# EAGLE design BUS (EAGLE 7.6.0)
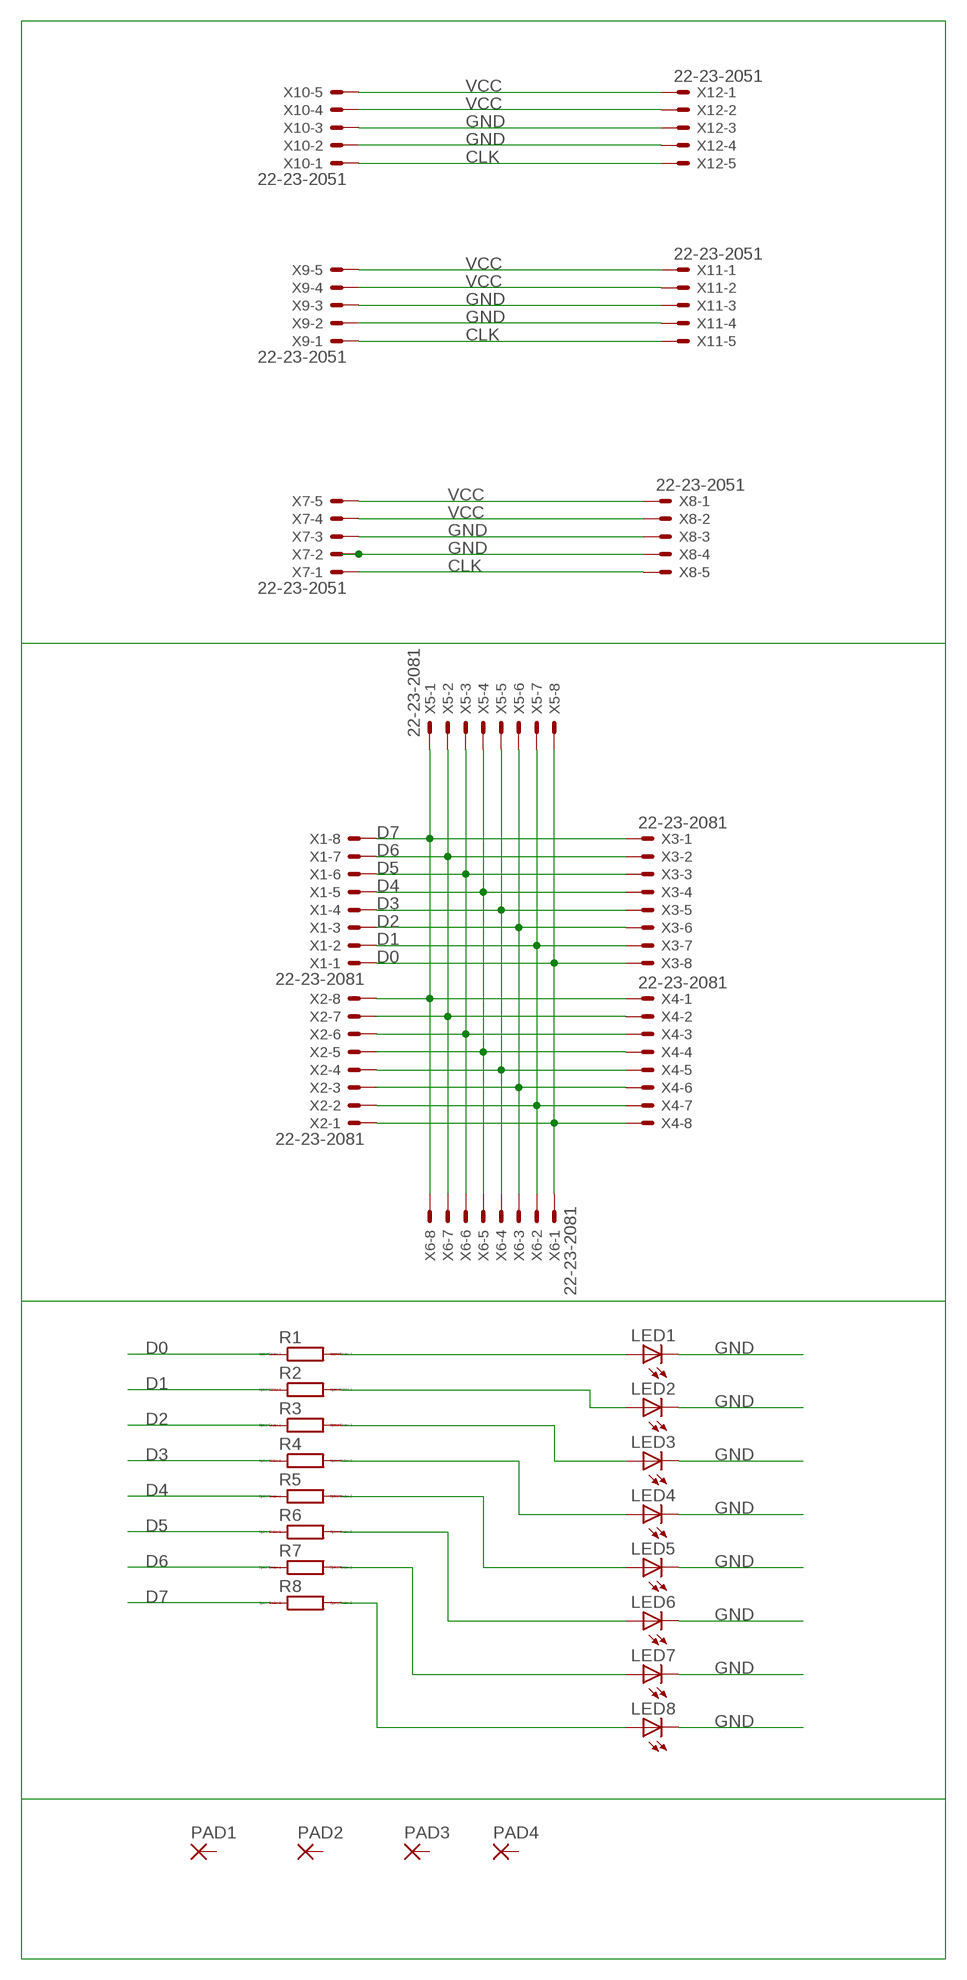
[diagram p0: schematic, sheet 1]

## Parts
LED1  LED5MM  [LED5MM]
LED2  LED5MM  [LED5MM]
LED3  LED5MM  [LED5MM]
LED4  LED5MM  [LED5MM]
LED5  LED5MM  [LED5MM]
LED6  LED5MM  [LED5MM]
LED7  LED5MM  [LED5MM]
LED8  LED5MM  [LED5MM]
PAD1  3,17/1,1  [3,17/1,1]
PAD2  3,17/1,1  [3,17/1,1]
PAD3  3,17/1,1  [3,17/1,1]
PAD4  3,17/1,1  [3,17/1,1]
R1  R0207/10  [0207/10]
R2  R0207/10  [0207/10]
R3  R0207/10  [0207/10]
R4  R0207/10  [0207/10]
R5  R0207/10  [0207/10]
R6  R0207/10  [0207/10]
R7  R0207/10  [0207/10]
R8  R0207/10  [0207/10]
X1  22-23-2081  [22-23-2081]
X2  22-23-2081  [22-23-2081]
X3  22-23-2081  [22-23-2081]
X4  22-23-2081  [22-23-2081]
X5  22-23-2081  [22-23-2081]
X6  22-23-2081  [22-23-2081]
X7  22-23-2051  [22-23-2051]
X8  22-23-2051  [22-23-2051]
X9  22-23-2051  [22-23-2051]
X10  22-23-2051  [22-23-2051]
X11  22-23-2051  [22-23-2051]
X12  22-23-2051  [22-23-2051]

## Nets
CLK [supply]: X7.1 X8.5 X9.1 X10.1 X11.5 X12.5
D0: R1.1 X1.1 X2.1 X3.8 X4.8 X5.8 X6.1
D1: R2.1 X1.2 X2.2 X3.7 X4.7 X5.7 X6.2
D2: R3.1 X1.3 X2.3 X3.6 X4.6 X5.6 X6.3
D3: R4.1 X1.4 X2.4 X3.5 X4.5 X5.5 X6.4
D4: R5.1 X1.5 X2.5 X3.4 X4.4 X5.4 X6.5
D5: R6.1 X1.6 X2.6 X3.3 X4.3 X5.3 X6.6
D6: R7.1 X1.7 X2.7 X3.2 X4.2 X5.2 X6.7
D7: R8.1 X1.8 X2.8 X3.1 X4.1 X5.1 X6.8
GND [supply]: LED1.K(C) LED2.K(C) LED3.K(C) LED4.K(C) LED5.K(C) LED6.K(C) LED7.K(C) LED8.K(C) X7.2 X7.3 X8.3 X8.4 X9.2 X9.3 X10.2 X10.3 X11.3 X11.4 X12.3 X12.4
N$9: LED1.A R1.2
N$10: LED2.A R2.2
N$11: LED3.A R3.2
N$12: LED4.A R4.2
N$13: LED5.A R5.2
N$14: LED6.A R6.2
N$15: LED7.A R7.2
N$16: LED8.A R8.2
VCC [supply]: X7.4 X7.5 X8.1 X8.2 X9.4 X9.5 X10.4 X10.5 X11.1 X11.2 X12.1 X12.2
Unconnected: PAD1.1(P) PAD2.1(P) PAD3.1(P) PAD4.1(P)

## Library data of the parts
LED1-LED8 = led:LED: LED OSRAM: - CHIPLED LG R971, LG N971, LY N971, LG Q971, LY Q971, LO R971, LY R971 LH N974, LH R974 LS Q976, LO Q976, LY Q976 LO Q996 - Hyper CHIPLED LW Q18S LB Q993, LB Q99A, LB R99A - SideLED LS A670, LO A670, LY A670, LG A670, LP A670 LB A673, LV A673, LT A673, LW A673 LH A674 LY A675 LS A676, LA A676, LO A676, LY A676, LW A676 LS A679, LY A679, LG A679 - Hyper Micro SIDELED® LS Y876, LA Y876, LO Y876, LY Y876 LT Y87S - SmartLED LW L88C, LW L88S LB L89C, LB L89S, LG L890 LS L89K, LO L89K, LY L89K LS L896, LA L896, LO L896, LY L896 - TOPLED LS T670, LO T670, LY T670, LG T670, LP T670 LSG T670, LSP T670, LSY T670, LOP T670, LYG T670 LG T671, LOG T671, LSG T671 LB T673, LV T673, LT T673, LW T673 LH T674 LS T676, LA T676, LO T676, LY T676, LB T676, LH T676, LSB T676, LW T676 LB T67C, LV T67C, LT T67C, LS T67K, LO T67K, LY T67K, LW E67C LS E67B, LA E67B, LO E67B, LY E67B, LB E67C, LV E67C, LT E67C LW T67C LS T679, LY T679, LG T679 LS T770, LO T770, LY T770, LG T770, LP T770 LB T773, LV T773, LT T773, LW T773 LH T774 LS E675, LA E675, LY E675, LS T675 LS T776, LA T776, LO T776, LY T776, LB T776 LHGB T686 LT T68C, LB T68C - Hyper Mini TOPLED® LB M676 - Mini TOPLED Santana® LG M470 LS M47K, LO M47K, LY M47K Source: http://www.osram.convergy.de LUXEON: - LUMILED® LXK2-PW12-R00, LXK2-PW12-S00, LXK2-PW14-U00, LXK2-PW14-V00 LXK2-PM12-R00, LXK2-PM12-S00, LXK2-PM14-U00 LXK2-PE12-Q00, LXK2-PE12-R00, LXK2-PE12-S00, LXK2-PE14-T00, LXK2-PE14-U00 LXK2-PB12-K00, LXK2-PB12-L00, LXK2-PB12-M00, LXK2-PB14-N00, LXK2-PB14-P00, LXK2-PB14-Q00 LXK2-PR12-L00, LXK2-PR12-M00, LXK2-PR14-Q00, LXK2-PR14-R00 LXK2-PD12-Q00, LXK2-PD12-R00, LXK2-PD12-S00 LXK2-PH12-R00, LXK2-PH12-S00 LXK2-PL12-P00, LXK2-PL12-Q00, LXK2-PL12-R00 Source: www.luxeon.com KINGBRIGHT: KA-3528ASYC Source: www.kingbright.com
PAD1-PAD4 = wirepad:3,17/1,1: THROUGH-HOLE PAD
R1-R8 = eagle-ltspice:R: RESISTOR, European symbol; SPICEMODEL: NONE; SPICEPREFIX: R
X1-X6 = con-molex:22-23-2081: .100" (2.54mm) Center Header - 8 Pin; MF: MOLEX; MPN: 22-23-2081; OC_FARNELL: 1756826; OC_NEWARK: 01C7592
X7-X12 = con-molex:22-23-2051: .100" (2.54mm) Center Header - 5 Pin; MF: MOLEX; MPN: 22-23-2051; OC_FARNELL: 1462952; OC_NEWARK: 38C9178

## Net classes
1 supply: width 2.032 mm

## Board
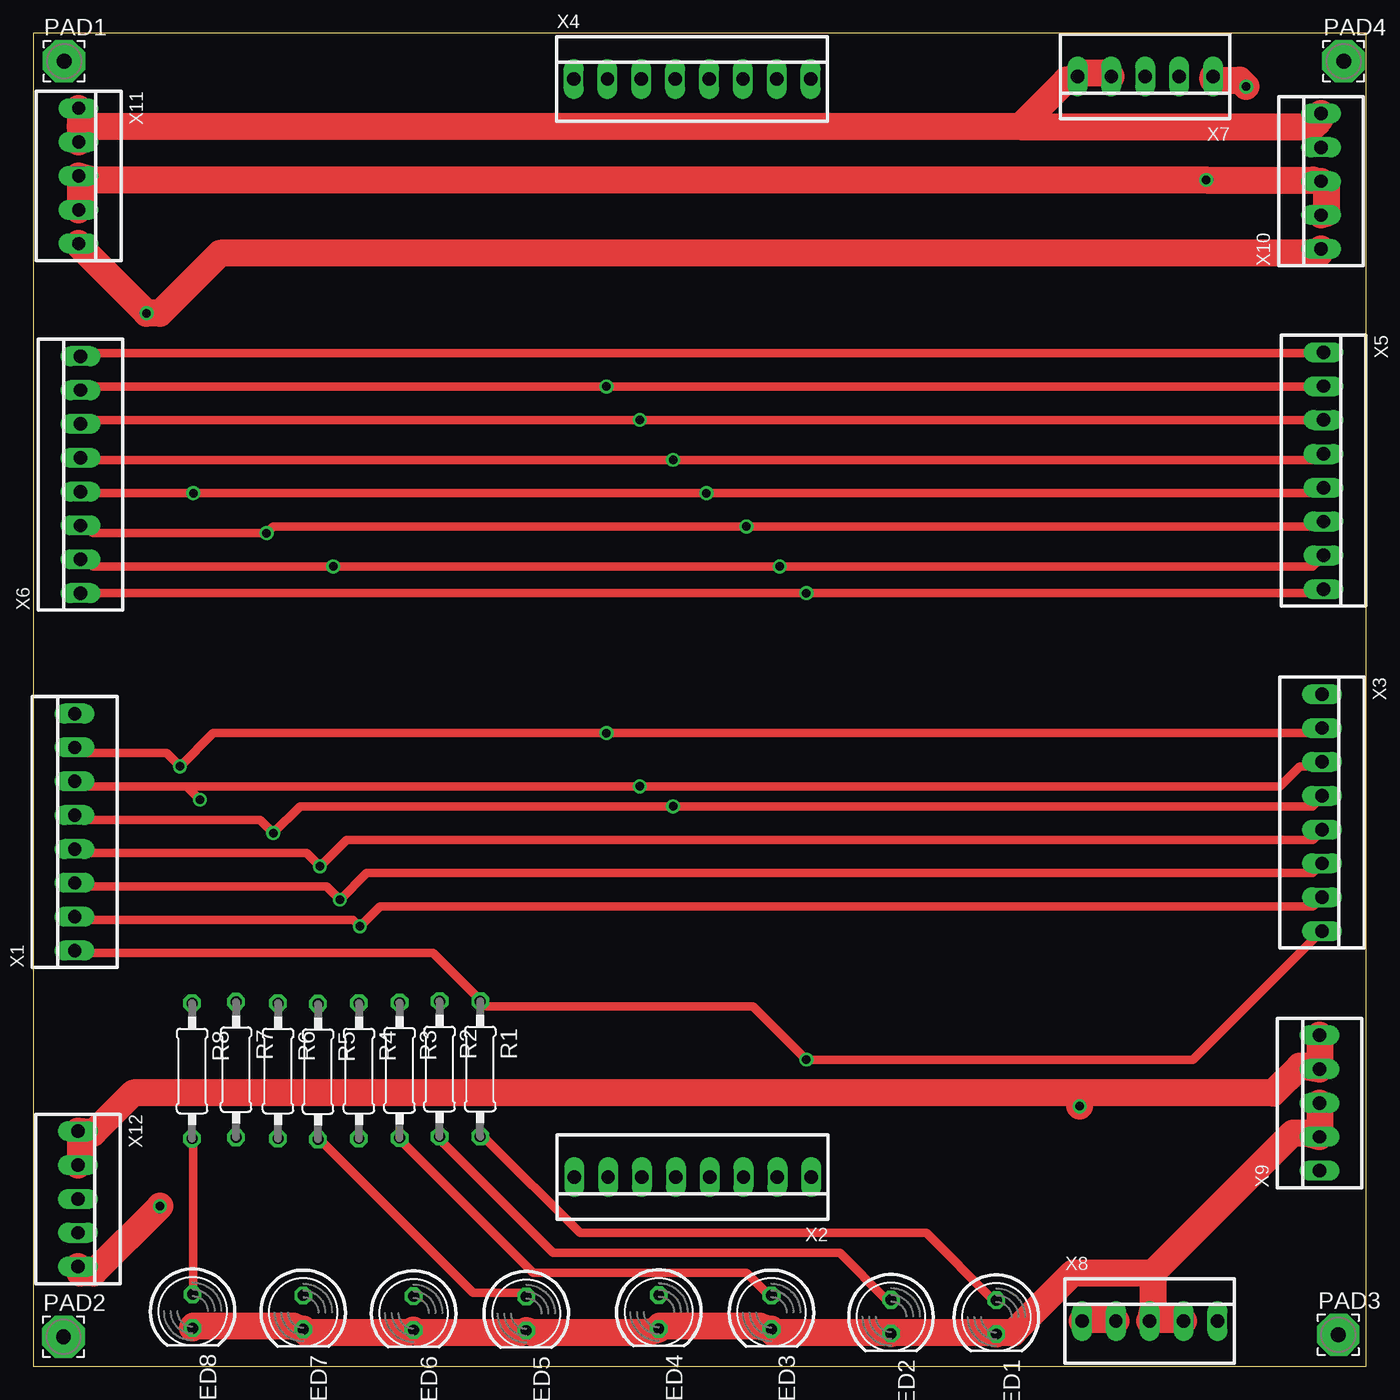
[diagram p1: board, top side]
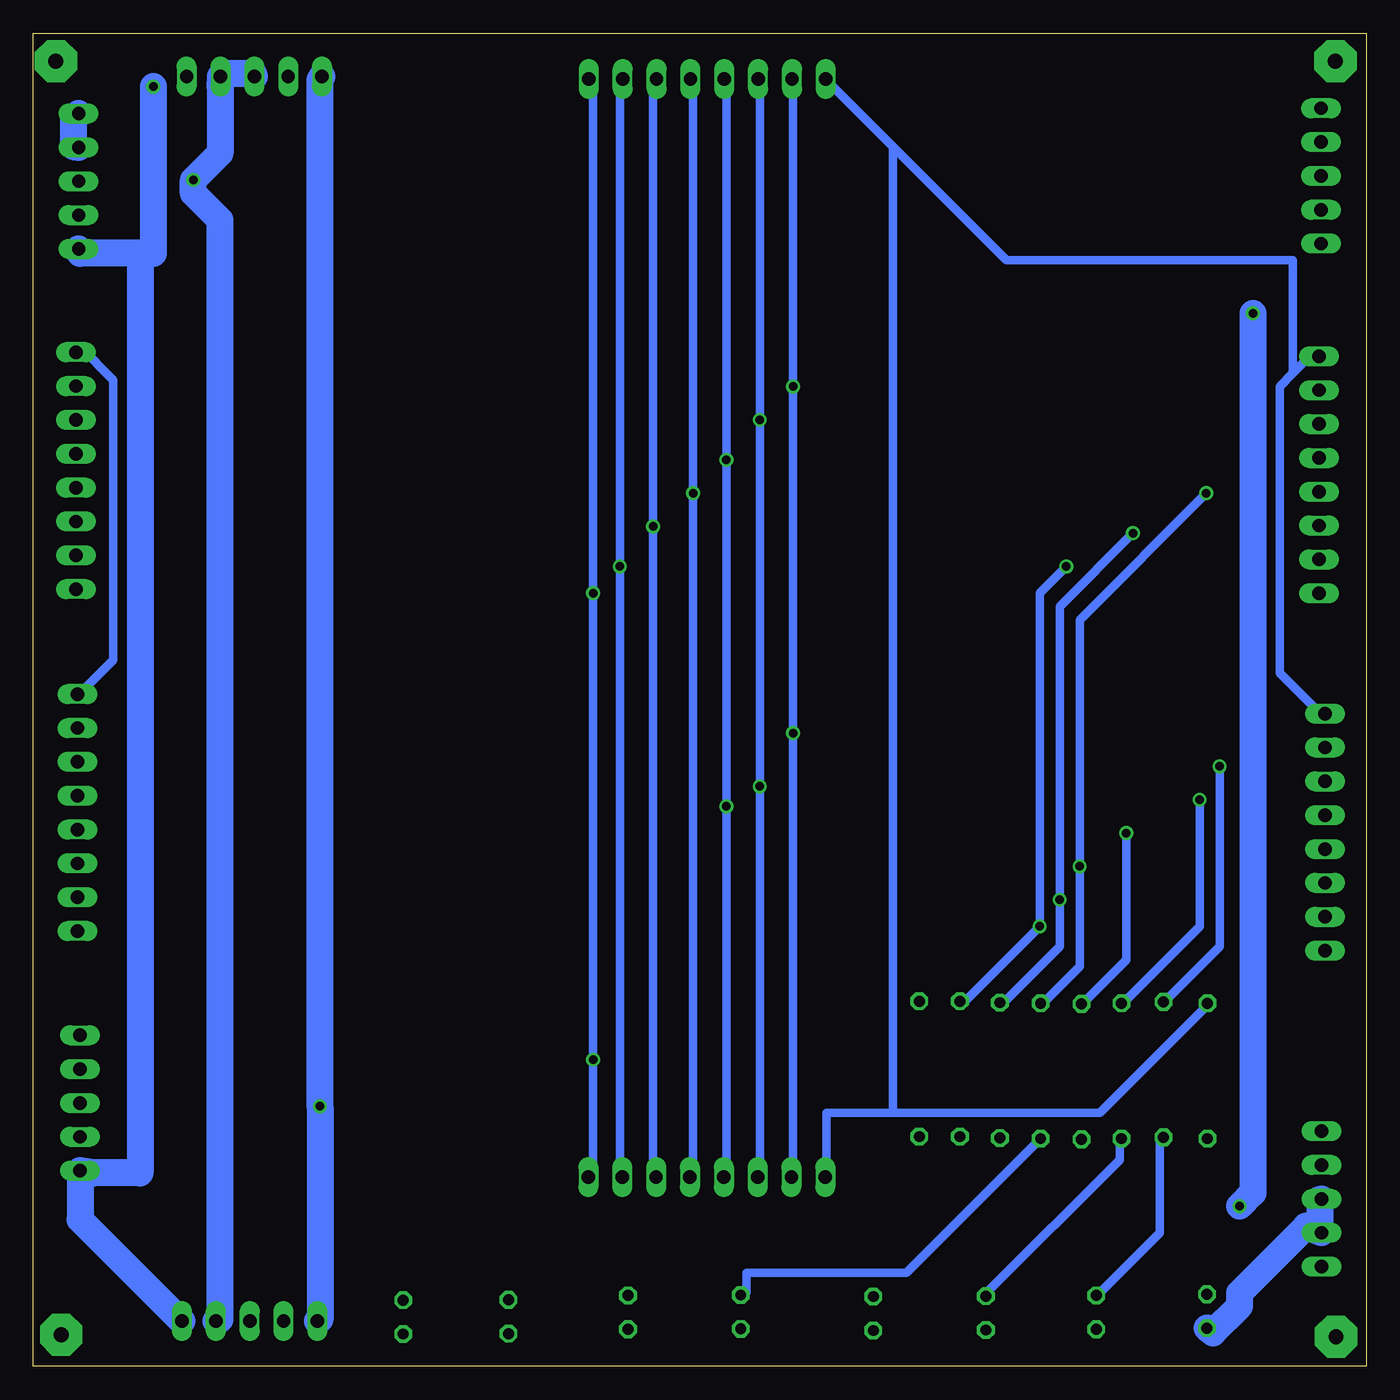
[diagram p2: board, bottom side, seen from below]

Size 100 x 100 mm. Coordinates in mm from the lower left corner, seen from the top.
Outline: 0,0 100,0 100,100 0,100 0,0
Copper layers (1*16): Top 0.035mm / dielectric 1.5mm / Bottom 0.035mm
Design rules "default *": minimum track width 25mil, minimum drill 25mil, track to track 25mil, track to pad 25mil, pad to pad 25mil, via to via 25mil, smd to smd 8mil, copper to edge 40mil, drill to drill 8mil, minimum pad ring 10mil, minimum via ring 8mil, stop-mask expansion 4mil, vias tented up to drill 0mil, thermal gap 10mil

### Footprints (pad centres in the part's own frame; a part is rotated, then mirrored left to right if it is on the bottom)
LED5MM = drill 0.813 octagon: A -1.27,0; K 1.27,0
3,17/1,1 = drill 1.118 pad 3.175 octagon: 1 0,0
0207/10 = drill 0.813 octagon: 1 -5.08,0; 2 5.08,0
22-23-2081 = drill 1 long: 1 -8.89,0; 2 -6.35,0; 3 -3.81,0; 4 -1.27,0; 5 1.27,0; 6 3.81,0; 7 6.35,0; 8 8.89,0
22-23-2051 = drill 1 long: 1 -5.08,0; 2 -2.54,0; 3 0,0; 4 2.54,0; 5 5.08,0

### Placement (x,y rotation side)
LED1  72.25,3.68 270 top
LED2  64.35,3.71 270 top
LED3  55.38,4.04 270 top
LED4  46.93,4.07 270 top
LED5  36.98,3.95 270 top
LED6  28.53,3.98 270 top
LED7  20.25,4.04 270 top
LED8  11.95,4.12 270 top
PAD1  2.31,97.91 0 top
PAD2  2.26,2.21 0 top
PAD3  97.91,2.36 0 top
PAD4  98.31,97.91 0 top
R1  33.53,22.3 270 top
R2  30.48,22.3 270 top
R3  27.48,22.2 270 top
R4  24.43,22.15 270 top
R5  21.36,22.1 270 top
R6  18.36,22.15 270 top
R7  15.21,22.25 270 top
R8  11.91,22.15 270 top
X1  3.1,40.07 90 top
X2  49.47,14.2 180 top
X3  96.68,41.53 270 top
X4  49.43,96.58 0 top
X5  96.81,67.18 270 top
X6  3.54,66.88 90 top
X7  83.42,96.76 180 top
X8  83.76,3.39 0 top
X9  96.5,19.75 90 top
X10  96.6,88.9 90 top
X11  3.4,89.3 270 top
X12  3.35,12.55 270 top

### Tracks (layer width: path | path; a pad name or v marks a point on that pad's centre or on a via)
CLK  (via drill 0.64)
  Top 2.032: v9.5,12 4.5,7 3.5,7 X12.5 | X11.5 3.5,84 v8.5,79 9.5,79 14,83.5 96.5,83.5 X10.1 | v91,96 90.5,96.5 88.5,96.5 X7.1
  Bottom 2.032: v9.5,12 8.5,13 v8.5,79 | X8.5 89,3.5 96.5,11 X9.1 95.5,14.5 92,14.5 92,83.5 | 92,83.5 91,83.5 v91,96 | 92,83.5 96.5,83.5 X10.1
D0  (via drill 0.64)
  Top 0.635: X6.1 4,58 v58,58 96.5,58 X5.8 | X1.1 3.5,31 30,31 33.5,27.5 R1.1 34,27 54,27 v58,23 87,23 96.5,32.5 X3.8
  Bottom 0.635: X2.1 58,14.5 v58,23 v58,58 58,96.5 X4.8
D1  (via drill 0.64)
  Top 0.635: X1.2 3.5,33.5 24,33.5 v24.5,33 26,34.5 96,34.5 X3.7 | X6.2 4,60.5 4.5,60 v22.5,60 v56,60 96,60 96.5,60.5 X5.7
  Bottom 0.635: X2.2 56,14.5 v56,60 56,96.5 X4.7 | R2.1 30,27.5 v24.5,33 24.5,58 v22.5,60
D2  (via drill 0.64)
  Top 0.635: X1.3 3.5,36 22,36 v23,35 25,37 96,37 96.5,37.5 X3.6 | X6.3 4,63 4.5,62.5 v17.5,62.5 18,63 v53.5,63 96.5,63 X5.6
  Bottom 0.635: X2.3 53.5,14.5 v53.5,63 53.5,96.5 X4.6 | R3.1 27,27.5 23,31.5 v23,35 23,57 v17.5,62.5
D3  (via drill 0.64)
  Top 0.635: X1.4 3.5,38.5 20.5,38.5 v21.5,37.5 23.5,39.5 96,39.5 96.5,40 X3.5 | X6.4 4,65.5 v12,65.5 v50.5,65.5 96.5,65.5 X5.5
  Bottom 0.635: X2.4 50.5,14.5 v50.5,65.5 50.5,96.5 X4.5 | R4.1 24,27.5 21.5,30 v21.5,37.5 21.5,56 v12,65.5
D4  (via drill 0.64)
  Top 0.635: X1.5 3.5,41 17,41 v18,40 20,42 v48,42 96,42 96.5,42.5 X3.4 | X6.5 4,68 v48,68 96.5,68 X5.4
  Bottom 0.635: v18,40 18,30.5 21,27.5 R5.1 | X2.5 48,14.5 v48,42 v48,68 48,96.5 X4.4
D5  (via drill 0.64)
  Top 0.635: 11.5,43.5 v12.5,42.5 | 11.5,43.5 3.5,43.5 X1.6 | 11.5,43.5 v45.5,43.5 93.5,43.5 95,45 96.5,45 X3.3 | X6.6 4,71 v45.5,71 96.5,71 X5.3
  Bottom 0.635: v12.5,42.5 12.5,33 18,27.5 R6.1 | X2.6 45.5,14.5 v45.5,43.5 v45.5,71 45.5,96.5 X4.3
D6  (via drill 0.64)
  Top 0.635: X1.7 3.5,46 10,46 v11,45 13.5,47.5 v43,47.5 96.5,47.5 X3.2 | X6.7 4,73.5 v43,73.5 96.5,73.5 X5.2
  Bottom 0.635: v11,45 11,31.5 15,27.5 R7.1 | X2.7 43,14.5 v43,47.5 v43,73.5 43,96.5 X4.2
D7
  Top 0.635: X5.1 96.5,76 4,76 X6.8
  Bottom 0.635: 35.5,19 40.5,19 40.5,14.5 X2.8 | 35.5,19 20,19 12,27 R8.1 | X3.1 96.5,50.5 94,53 94,74 96.5,76.5 X5.1 | 5.5,74.5 4,76 X6.8 | 5.5,74.5 6.5,73.5 6.5,52 3.5,49 X1.8 | 35.5,91.5 27,83 5.5,83 5.5,74.5 | 35.5,91.5 40.5,96.5 X4.1 | 35.5,91.5 35.5,19
GND  (via drill 0.64)
  Top 2.032: X11.4 3.5,87 3.5,89 X11.3 4.5,89 v88,89 96,89 X10.3 97,88.5 97,86.5 X10.2 | LED8.K 12,3 19.5,3 LED7.K 20.5,2.5 28,2.5 LED6.K 29,2.5 36.5,2.5 LED5.K 37.5,2.5 46,2.5 LED4.K 47,3 54.5,3 LED3.K 55.5,2.5 64.5,2.5 | X9.3 X9.2 95.5,17.5 94.5,17.5 84,7 | X8.4 86,3.5 84,3.5 X8.3 84,4.5 84,7 | 72,2.5 64.5,2.5 | 64.5,2.5 LED2.K | 72,2.5 LED1.K | 84,7 78,7 73.5,2.5 72,2.5
  Bottom 2.032: X7.3 83.5,97 85.5,97 X7.2 86,96 86,91 v88,89 88,88 86,86 86,3.5 X8.4 | X12.3 3.5,12.5 3.5,10.5 X12.4 4.5,10.5 9.5,5.5 9.5,4.5 11.5,2.5 LED8.K
N$9
  Top 0.635: R1.2 34,17 41,10 67,10 72,5 LED1.A
N$10
  Top 0.635: R2.2 30.5,17 39,8.5 60.5,8.5 64,5 LED2.A
N$11
  Top 0.635: R3.2 27.5,17 37.5,7 53.5,7 55,5.5 LED3.A
N$12
  Bottom 0.635: R4.2 34.5,7 46.5,7 46.5,5.5 LED4.A
N$13
  Top 0.635: R5.2 21.5,17 33,5.5 36.5,5.5 LED5.A
N$14
  Bottom 0.635: LED6.A 28.5,5.5 18.5,15.5 18.5,17 R6.2
N$15
  Bottom 0.635: LED7.A 20,5.5 15.5,10 15.5,17 R7.2
N$16
  Top 0.635: R8.2 12,17 12,5.5 LED8.A
VCC  (via drill 0.64)
  Top 2.032: 3.5,93 3.5,94 X11.1 | 3.5,93 3.5,92 X11.2 | X7.4 80.5,97 78.5,97 X7.5 77.5,96.5 74,93 | 74,93 3.5,93 | 74,93 96,93 96.5,93.5 X10.5 | X8.1 79,3.5 81,3.5 X8.2 | X12.2 3.5,15.5 3.5,17.5 X12.1 4.5,17.5 7.5,20.5 78.5,20.5 | X9.5 X9.4 95.5,22.5 95,22.5 93,20.5 78.5,20.5 | v78.5,19.5 78.5,20.5
  Bottom 2.032: X10.4 97,91.5 97,93.5 X10.5 | X8.1 78.5,3.5 v78.5,19.5 78.5,96.5 X7.5